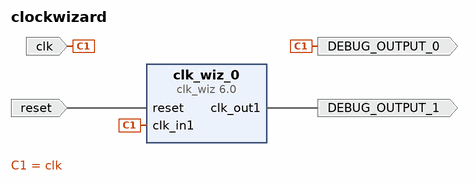
[diagram p0: block diagram of the top level]
# Vivado block design clockwizard, xc7z020clg484-1, Vivado 2024.2
create_bd_design clockwizard

create_bd_port -dir I -type clk clk
create_bd_port -dir I -type rst reset
set_property -dict {CONFIG.POLARITY ACTIVE_HIGH} [get_bd_ports reset]
create_bd_port -dir O -type clk DEBUG_OUTPUT_1
create_bd_port -dir O -type clk DEBUG_OUTPUT_0

create_bd_cell -type ip -vlnv xilinx.com:ip:clk_wiz:6.0 clk_wiz_0
set_property -dict [list \
  CONFIG.CLKOUT1_JITTER 110.209 \
  CONFIG.CLKOUT1_REQUESTED_OUT_FREQ 250 \
  CONFIG.MMCM_CLKOUT0_DIVIDE_F 4.000 \
  CONFIG.RESET_PORT reset \
  CONFIG.RESET_TYPE ACTIVE_HIGH \
  CONFIG.USE_LOCKED false \
] [get_bd_cells clk_wiz_0]

# ---- connections ----

connect_bd_net -net clk_in1_0_1 [get_bd_ports clk] [get_bd_pins clk_wiz_0/clk_in1] [get_bd_ports DEBUG_OUTPUT_0]
connect_bd_net [get_bd_pins clk_wiz_0/clk_out1] [get_bd_ports DEBUG_OUTPUT_1]
connect_bd_net -net reset_0_1 [get_bd_ports reset] [get_bd_pins clk_wiz_0/reset]

validate_bd_design
save_bd_design
